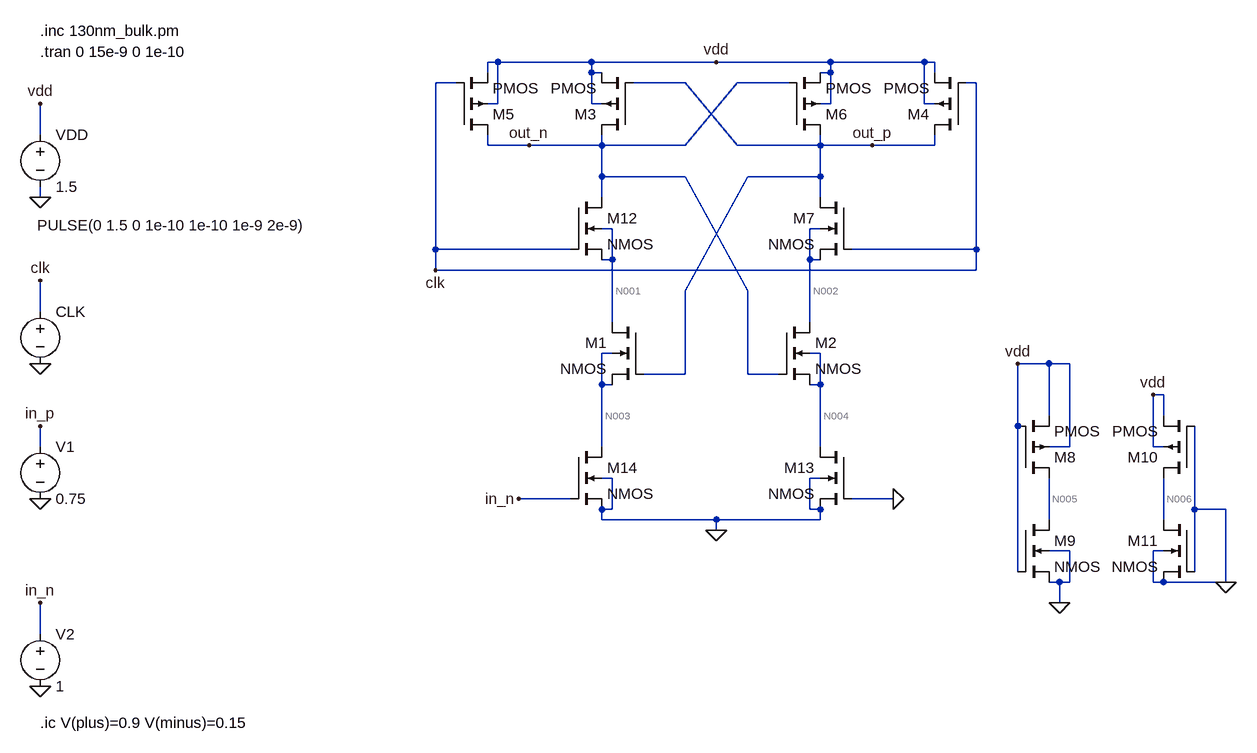
[diagram p0: schematic compromis_row_amplifaer.asc]
compromis_row_amplifaer.asc, the LTspice schematic file:
Version 4
SHEET 1 1524 724
WIRE -384 -544 -400 -544
WIRE -240 -544 -384 -544
WIRE -48 -544 -240 -544
WIRE 128 -544 -48 -544
WIRE 272 -544 128 -544
WIRE 288 -544 272 -544
WIRE -400 -528 -400 -544
WIRE -240 -528 -240 -544
WIRE -224 -528 -240 -528
WIRE 128 -528 128 -544
WIRE 128 -528 112 -528
WIRE 288 -528 288 -544
WIRE -448 -512 -480 -512
WIRE -96 -512 -176 -512
WIRE 64 -512 -16 -512
WIRE 352 -512 336 -512
WIRE -384 -480 -384 -544
WIRE -384 -480 -400 -480
WIRE -240 -480 -240 -528
WIRE -224 -480 -240 -480
WIRE 128 -480 128 -528
WIRE 128 -480 112 -480
WIRE 272 -480 272 -544
WIRE 288 -480 272 -480
WIRE -1088 -432 -1088 -480
WIRE -400 -416 -400 -432
WIRE -336 -416 -400 -416
WIRE -224 -416 -224 -432
WIRE -224 -416 -336 -416
WIRE -96 -416 -16 -512
WIRE -96 -416 -224 -416
WIRE -16 -416 -96 -512
WIRE 112 -416 112 -432
WIRE 112 -416 -16 -416
WIRE 192 -416 112 -416
WIRE 288 -416 288 -432
WIRE 288 -416 192 -416
WIRE -224 -368 -224 -416
WIRE -96 -368 -224 -368
WIRE 112 -368 112 -416
WIRE 112 -368 0 -368
WIRE -1088 -336 -1088 -352
WIRE -224 -336 -224 -368
WIRE 112 -336 112 -368
WIRE -208 -288 -224 -288
WIRE 112 -288 96 -288
WIRE -480 -256 -480 -512
WIRE -272 -256 -480 -256
WIRE 352 -256 352 -512
WIRE 352 -256 160 -256
WIRE -208 -240 -208 -288
WIRE -208 -240 -224 -240
WIRE 96 -240 96 -288
WIRE 112 -240 96 -240
WIRE -480 -224 -480 -256
WIRE 352 -224 352 -256
WIRE 352 -224 -480 -224
WIRE -96 -192 0 -368
WIRE 0 -192 -96 -368
WIRE -1088 -160 -1088 -208
WIRE -208 -144 -208 -240
WIRE 96 -144 96 -240
WIRE -208 -96 -224 -96
WIRE 112 -96 96 -96
WIRE 464 -80 416 -80
WIRE 496 -80 464 -80
WIRE -96 -64 -96 -192
WIRE -96 -64 -160 -64
WIRE 0 -64 0 -192
WIRE 48 -64 0 -64
WIRE -224 -48 -224 -96
WIRE -208 -48 -224 -48
WIRE 112 -48 112 -96
WIRE 112 -48 96 -48
WIRE 640 -32 624 -32
WIRE 464 0 464 -80
WIRE 640 0 640 -32
WIRE 416 16 416 -80
WIRE -1088 48 -1088 16
WIRE -224 48 -224 -48
WIRE 112 48 112 -48
WIRE 496 48 496 -80
WIRE 496 48 464 48
WIRE 624 48 624 -32
WIRE 640 48 624 48
WIRE -208 96 -224 96
WIRE 112 96 96 96
WIRE -272 128 -352 128
WIRE 224 128 160 128
WIRE -208 144 -208 96
WIRE -208 144 -224 144
WIRE 96 144 96 96
WIRE 112 144 96 144
WIRE 688 144 688 16
WIRE 736 144 688 144
WIRE -224 160 -224 144
WIRE -48 160 -224 160
WIRE 112 160 112 144
WIRE 112 160 -48 160
WIRE 464 160 464 96
WIRE 640 160 640 96
WIRE -48 176 -48 160
WIRE 496 208 464 208
WIRE 640 208 624 208
WIRE 416 240 416 16
WIRE 688 240 688 144
WIRE 480 256 464 256
WIRE 496 256 496 208
WIRE 496 256 480 256
WIRE 624 256 624 208
WIRE 640 256 624 256
WIRE 736 256 736 144
WIRE 736 256 640 256
WIRE 480 288 480 256
WIRE -1088 336 -1088 288
FLAG -1088 -80 0
FLAG 480 288 0
FLAG -1088 -336 0
FLAG 736 256 0
FLAG -48 -544 vdd
FLAG 624 -32 vdd
FLAG 416 -80 vdd
FLAG -1088 -480 vdd
FLAG -1088 -208 clk
FLAG -336 -416 out_n
FLAG 192 -416 out_p
FLAG -480 -224 clk
FLAG -48 176 0
FLAG -1088 128 0
FLAG -1088 416 0
FLAG -1088 16 in_p
FLAG -1088 288 in_n
FLAG 224 128 0
FLAG -352 128 in_n
SYMBOL nmos4 -160 -144 M0
SYMATTR InstName M1
SYMATTR Value2 l=130e-9 w=1300e-9 ad=676000e-18 as=676000e-18 pd=3640e-9 ps=3640e-9
SYMBOL nmos4 48 -144 R0
SYMATTR InstName M2
SYMATTR Value2 l=130e-9 w=1300e-9 ad=676000e-18 as=676000e-18 pd=3640e-9 ps=3640e-9
SYMBOL pmos4 -176 -432 R180
SYMATTR InstName M3
SYMATTR Value2 l=130e-9 w=2600e-9 ad=676000e-18 as=676000e-18 pd=3640e-9 ps=3640e-9
SYMBOL pmos4 64 -432 M180
SYMATTR InstName M6
SYMATTR Value2 l=130e-9 w=2600e-9 ad=676000e-18 as=676000e-18 pd=3640e-9 ps=3640e-9
SYMBOL pmos4 336 -432 R180
SYMATTR InstName M4
SYMATTR Value2 l=130e-9 w=2600e-9 ad=676000e-18 as=676000e-18 pd=3640e-9 ps=3640e-9
SYMBOL pmos4 -448 -432 M180
SYMATTR InstName M5
SYMATTR Value2 l=130e-9 w=2600e-9 ad=676000e-18 as=676000e-18 pd=3640e-9 ps=3640e-9
SYMBOL pmos4 416 96 M180
SYMATTR InstName M8
SYMATTR Value2 l=130e-9 w=2600e-9 ad=676000e-18 as=676000e-18 pd=3640e-9 ps=3640e-9
SYMBOL nmos4 416 160 R0
SYMATTR InstName M9
SYMATTR Value2 l=130e-9 w=1300e-9 ad=676000e-18 as=676000e-18 pd=3640e-9 ps=3640e-9
SYMBOL pmos4 688 96 R180
SYMATTR InstName M10
SYMATTR Value2 l=130e-9 w=2600e-9 ad=676000e-18 as=676000e-18 pd=3640e-9 ps=3640e-9
SYMBOL nmos4 688 160 M0
SYMATTR InstName M11
SYMATTR Value2 l=130e-9 w=1300e-9 ad=676000e-18 as=676000e-18 pd=3640e-9 ps=3640e-9
SYMBOL voltage -1088 -176 R0
WINDOW 123 0 0 Left 0
WINDOW 39 0 0 Left 0
WINDOW 3 -5 -117 Left 2
SYMATTR Value PULSE(0 1.5 0 1e-10 1e-10 1e-9 2e-9)
SYMATTR InstName CLK
SYMBOL nmos4 160 -336 M0
SYMATTR InstName M7
SYMATTR Value2 l=130e-9 w=1300e-9 ad=676000e-18 as=676000e-18 pd=3640e-9 ps=3640e-9
SYMBOL nmos4 -272 -336 R0
SYMATTR InstName M12
SYMATTR Value2 l=130e-9 w=1300e-9 ad=676000e-18 as=676000e-18 pd=3640e-9 ps=3640e-9
SYMBOL nmos4 160 48 M0
SYMATTR InstName M13
SYMATTR Value2 l=130e-9 w=1300e-9 ad=676000e-18 as=676000e-18 pd=3640e-9 ps=3640e-9
SYMBOL nmos4 -272 48 R0
SYMATTR InstName M14
SYMATTR Value2 l=130e-9 w=1300e-9 ad=676000e-18 as=676000e-18 pd=3640e-9 ps=3640e-9
SYMBOL voltage -1088 -448 R0
WINDOW 123 0 0 Left 0
WINDOW 39 0 0 Left 0
SYMATTR InstName VDD
SYMATTR Value 1.5
SYMBOL voltage -1088 32 R0
WINDOW 123 0 0 Left 0
WINDOW 39 0 0 Left 0
SYMATTR InstName V1
SYMATTR Value 0.75
SYMBOL voltage -1088 320 R0
WINDOW 123 0 0 Left 0
WINDOW 39 0 0 Left 0
SYMATTR InstName V2
SYMATTR Value 1
TEXT -1088 -560 Left 2 !.tran 0 15e-9 0 1e-10
TEXT -1088 -592 Left 2 !.inc 130nm_bulk.pm
TEXT -1088 472 Left 2 !.ic V(plus)=0.9 V(minus)=0.15

The netlist it stands for:
* compromis_row_amplifaer.asc
M1 N001 out_p N003 N003 NMOS l=130e-9 w=1300e-9 ad=676000e-18 as=676000e-18 pd=3640e-9 ps=3640e-9
M2 N002 out_n N004 N004 NMOS l=130e-9 w=1300e-9 ad=676000e-18 as=676000e-18 pd=3640e-9 ps=3640e-9
M3 out_n out_p vdd vdd PMOS l=130e-9 w=2600e-9 ad=676000e-18 as=676000e-18 pd=3640e-9 ps=3640e-9
M6 out_p out_n vdd vdd PMOS l=130e-9 w=2600e-9 ad=676000e-18 as=676000e-18 pd=3640e-9 ps=3640e-9
M4 out_p clk vdd vdd PMOS l=130e-9 w=2600e-9 ad=676000e-18 as=676000e-18 pd=3640e-9 ps=3640e-9
M5 out_n clk vdd vdd PMOS l=130e-9 w=2600e-9 ad=676000e-18 as=676000e-18 pd=3640e-9 ps=3640e-9
M8 N005 vdd vdd vdd PMOS l=130e-9 w=2600e-9 ad=676000e-18 as=676000e-18 pd=3640e-9 ps=3640e-9
M9 N005 vdd 0 0 NMOS l=130e-9 w=1300e-9 ad=676000e-18 as=676000e-18 pd=3640e-9 ps=3640e-9
M10 N006 0 vdd vdd PMOS l=130e-9 w=2600e-9 ad=676000e-18 as=676000e-18 pd=3640e-9 ps=3640e-9
M11 N006 0 0 0 NMOS l=130e-9 w=1300e-9 ad=676000e-18 as=676000e-18 pd=3640e-9 ps=3640e-9
V§CLK clk 0 PULSE(0 1.5 0 1e-10 1e-10 1e-9 2e-9)
M7 out_p clk N002 N002 NMOS l=130e-9 w=1300e-9 ad=676000e-18 as=676000e-18 pd=3640e-9 ps=3640e-9
M12 out_n clk N001 N001 NMOS l=130e-9 w=1300e-9 ad=676000e-18 as=676000e-18 pd=3640e-9 ps=3640e-9
M13 N004 0 0 0 NMOS l=130e-9 w=1300e-9 ad=676000e-18 as=676000e-18 pd=3640e-9 ps=3640e-9
M14 N003 in_n 0 0 NMOS l=130e-9 w=1300e-9 ad=676000e-18 as=676000e-18 pd=3640e-9 ps=3640e-9
VDD vdd 0 1.5
V1 in_p 0 0.75
V2 in_n 0 1
.model NMOS NMOS
.model PMOS PMOS
.lib standard.mos
.tran 0 15e-9 0 1e-10
.inc 130nm_bulk.pm
.ic V(plus)=0.9 V(minus)=0.15
.backanno
.end

* Results of the author's LTspice run, read from the files saved beside the schematic
* Operating Point, zero values left out:
*   V(n001) = 37.11 µV
*   V(out_p) = 1.5 V
*   V(n003) = 21.61 µV
*   V(n002) = 296.6 mV
*   V(out_n) = 1.5 V
*   V(n004) = 296.6 mV
*   V(vdd) = 1.5 V
*   V(n005) = 24.46 µV
*   V(n006) = 1.5 V
*   V(in_n) = 1 V
*   V(in_p) = 750 mV
*   Id(M10) = -59.94 nA
*   Ig(M10) = -126.7 pA
*   Ib(M10) = 81.35 pA
*   Is(M10) = 59.99 nA
*   Id(M8) = -93.14 nA
*   Ig(M8) = 22.65 pA
*   Ib(M8) = 257.8 pA
*   Is(M8) = 92.86 nA
*   Id(M5) = -64.37 nA
*   Ig(M5) = -126.7 pA
*   Ib(M5) = 81.35 pA
*   Is(M5) = 64.41 nA
*   Id(M4) = -33.72 nA
*   Ig(M4) = -126.7 pA
*   Ib(M4) = 81.35 pA
*   Is(M4) = 33.76 nA
*   Id(M3) = -1.661 pA
*   Is(M3) = 1.661 pA
*   Id(M14) = 81.62 nA
*   Ig(M14) = 1.171 nA
*   Is(M14) = -82.79 nA
*   Id(M13) = 4.539 nA
*   Is(M13) = -4.538 nA
*   Id(M12) = 59.88 nA
*   Ig(M12) = -5.967 nA
*   Ib(M12) = -188.5 pA
*   Is(M12) = -53.73 nA
*   Id(M7) = 6.019 nA
*   Ig(M7) = -5.968 nA
*   Ib(M7) = -44.46 pA
*   Is(M7) = -6.623 pA
*   Id(M11) = 59.94 nA
*   Ig(M11) = -5.967 nA
*   Ib(M11) = -188.7 pA
*   Is(M11) = -53.79 nA
*   Id(M9) = 93.14 nA
*   Ig(M9) = 27.71 nA
*   Ib(M9) = -30.81 pA
*   Is(M9) = -120.8 nA
*   Id(M2) = 51.09 pA
*   Ig(M2) = 4.488 nA
*   Is(M2) = -4.539 nA
*   Id(M1) = 53.92 nA
*   Ig(M1) = 27.7 nA
*   Ib(M1) = -30.8 pA
*   Is(M1) = -81.59 nA
*   I(V2) = -1.171 nA
*   I(Vdd) = -279.3 nA
*   I(Clk) = 12.19 nA
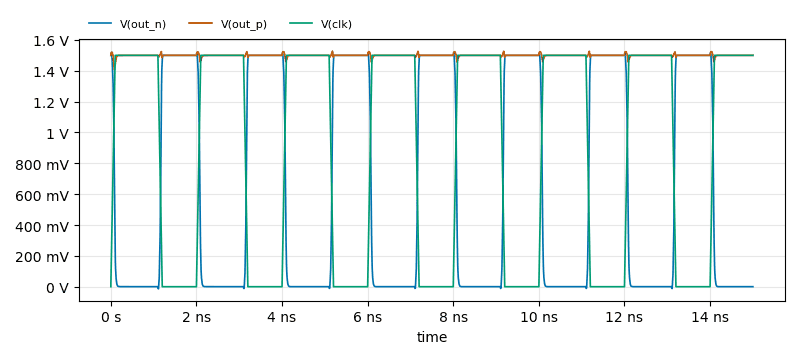
[diagram p1: Transient Analysis of compromis_row_amplifaer.asc, plotted from the saved traces]
* Transient Analysis, 1 run:
*   V(out_n): min -13.88 mV, max 1.517 V, average 645.3 mV, rms 970.4 mV, last 168.6 µV
*   V(out_p): min 1.406 V, max 1.527 V, average 1.5 V, rms 1.5 V, last 1.5 V
*   V(clk): min 0 V, max 1.5 V, average 865 mV, rms 1.123 V, last 1.5 V